# EAGLE design attiny2313devbdfinal1 (EAGLE 5.06)
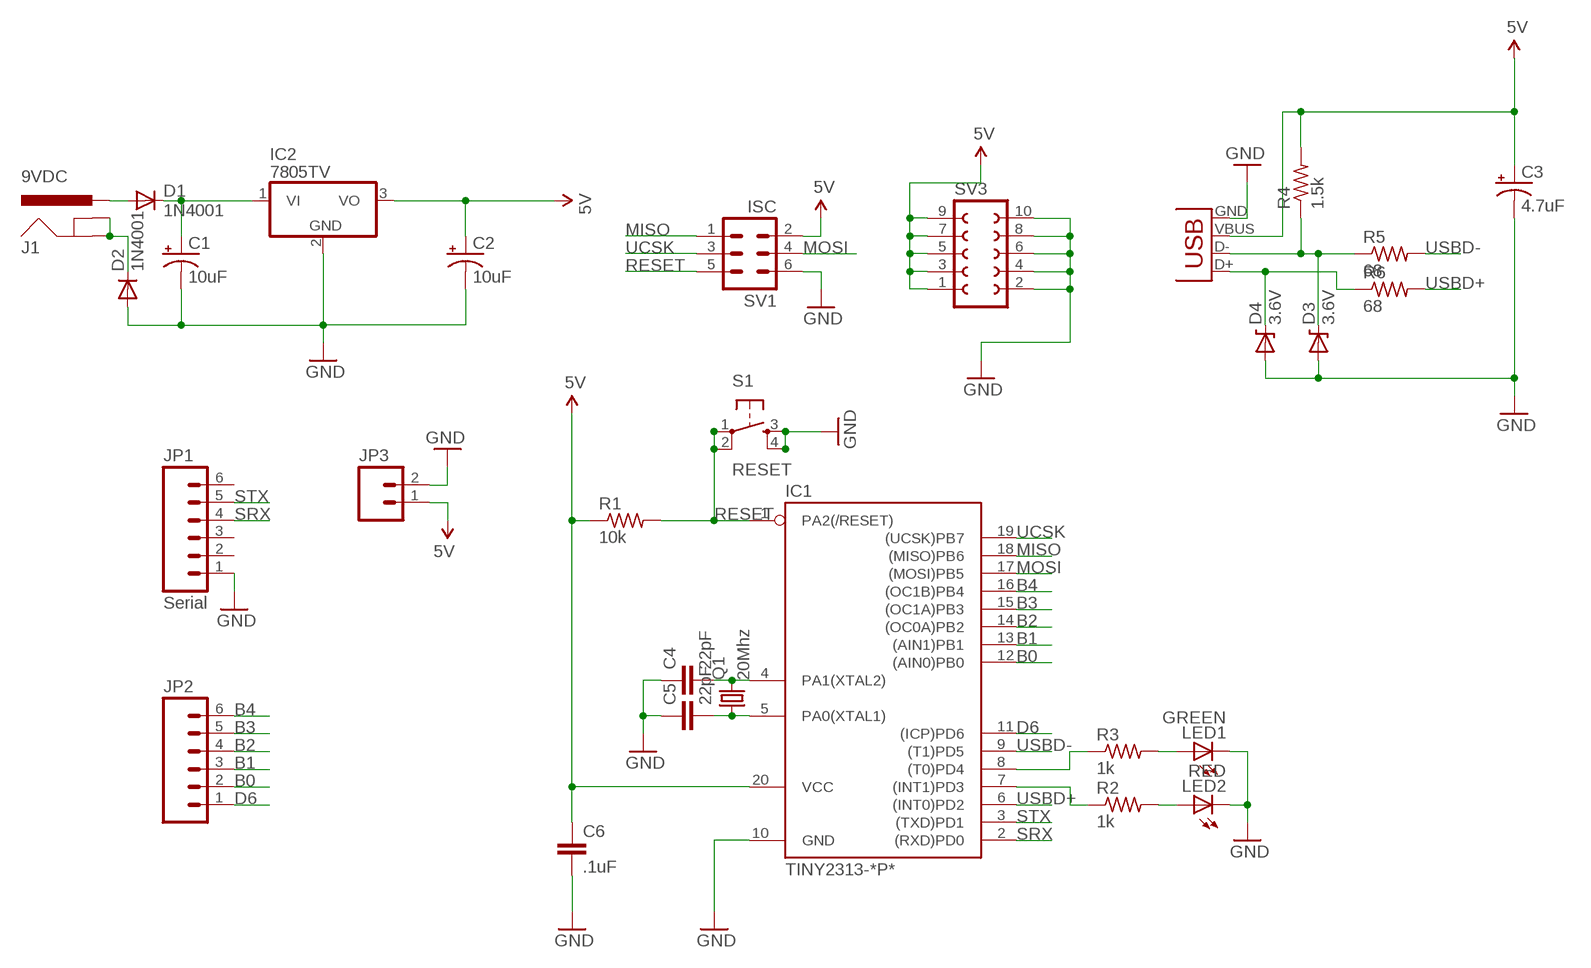
[diagram p0: schematic, sheet 1]

## Parts
C1  10uF  CAP_POLPTH2  [CPOL-RADIAL-10UF-25V]
C2  10uF  CAP_POLPTH2  [CPOL-RADIAL-10UF-25V]
C3  4.7uF  CAP_POLPTH2  [CPOL-RADIAL-10UF-25V]
C4  22pF  CAPPTH2  [CAP-PTH-SMALL2]
C5  22pF  CAPPTH2  [CAP-PTH-SMALL2]
C6  .1uF  CAPPTH2  [CAP-PTH-SMALL2]
D1  1N4001  DIODEPTH  [DIODE-1N4001]
D2  1N4001  DIODEPTH  [DIODE-1N4001]
D3  3.6V  DIODE-ZENERPTH  [DIODE-ZENER]
D4  3.6V  DIODE-ZENERPTH  [DIODE-ZENER]
IC1  TINY2313-*P*  [DIL20]
IC2  7805TV  [TO220V]
J1  9VDC  POWER_JACKPTH  [POWER_JACK_PTH]
JP1  Serial  M06SIP  [1X06]
JP2  M06SIP  [1X06]
JP3  M02PTH  [1X02]
LED1  GREEN  LED3MM  [LED3MM]
LED2  RED  LED3MM  [LED3MM]
Q1  20Mhz  CRYSTALHC49UV  [HC49U-V]
R1  10k  R-US_0207/10  [0207/10]
R2  1k  R-US_0207/10  [0207/10]
R3  1k  R-US_0207/10  [0207/10]
R4  1.5k  R-US_0207/10  [0207/10]
R5  68  R-US_0207/10  [0207/10]
R6  68  R-US_0207/10  [0207/10]
S1  RESET  TAC_SWITCHPTH  [TACTILE-PTH]
SV1  ISC  ML6  [ML6]
SV3  FE05-2  [FE05-2]
X1  USBPTH  [USB-B-PTH]

## Nets
5V [5V]: C2.1(+) C3.1(+) C6.1 IC1.20(VCC) IC2.3(VO) JP3.1 R1.1 R4.2 SV1.2 SV3.1 SV3.3 SV3.5 SV3.7 SV3.9 X1.VBUS
B0: IC1.12((AIN0)PB0) JP2.2
B1: IC1.13((AIN1)PB1) JP2.3
B2: IC1.14((OC0A)PB2) JP2.4
B3: IC1.15((OC1A)PB3) JP2.5
B4: IC1.16((OC1B)PB4) JP2.6
D6: IC1.11((ICP)PD6) JP2.1
GND [GND]: C1.2(-) C2.2(-) C3.2(-) C4.1 C5.1 C6.2 D2.A D3.P$2(A) D4.P$2(A) IC1.10(GND) IC2.2(GND) JP1.1 JP3.2 LED1.K(C) LED2.K(C) S1.3 S1.4 SV1.6 SV3.2 SV3.4 SV3.6 SV3.8 SV3.10 X1.GND
MISO: IC1.18((MISO)PB6) SV1.1
MOSI: IC1.17((MOSI)PB5) SV1.4
N$1: D1.A J1.PWR
N$2: C1.1(+) D1.C IC2.1(VI)
N$3: D2.C J1.GND J1.GNDBREAK
N$4: IC1.8((T0)PD4) R3.1
N$5: IC1.7((INT1)PD3) R2.1
N$6: C4.2 IC1.4(PA1(XTAL2)) Q1.2
N$7: C5.2 IC1.5(PA0(XTAL1)) Q1.1
N$8: LED2.A R2.2
N$9: LED1.A R3.2
N$10: D3.P$1(C) R4.1 R5.1 X1.D-
N$11: D4.P$1(C) R6.1 X1.D+
RESET: IC1.1(PA2(/RESET)) R1.2 S1.1 S1.2 SV1.5
SRX: IC1.2((RXD)PD0) JP1.4
STX: IC1.3((TXD)PD1) JP1.5
UCSK: IC1.19((UCSK)PB7) SV1.3
USBD+: IC1.6((INT0)PD2) R6.2
USBD-: IC1.9((T1)PD5) R5.2
Unconnected: JP1.2 JP1.3 JP1.6

## Library data of the parts
C1-C3 = SparkFun:CAP_POL: Capacitor Polarized These are standard SMD and PTH capacitors. Normally 10uF, 47uF, and 100uF in electrolytic and tantalum varieties. Always verify the external diameter of the through hole cap, it varies with capacity, voltage, and manufacturer. The EIA devices should be standard.
C4-C6 = SparkFun:CAP: Capacitor Standard 0603 ceramic capacitor, and 0.1" leaded capacitor.
D1 D2 = SparkFun:DIODE: Diode These are standard reverse protection diodes and small signal diodes. SMA package can handle up to about 1A. SOD-323 can handle about 200mA. What the SOD-323 package when ordering, there are some mfgs out there that are 5-pin packages.
D3 D4 = SparkFun:DIODE-ZENER: Zener Diode Production Part - 8199 3.4V Zener Voltage
IC1 = avr-6:TINY2313*: Atmel Tiny2313 2K Flash, 128 bytes EEPROM, 128 bytes RAM
IC2 = linear:78*: Positive VOLTAGE REGULATOR Source: http://cache.national.com/ds/LM/LM78L05.pdf http://www.fairchildsemi.com/ds/LM/LM7805.pdf
J1 = SparkFun:POWER_JACK: Power Jack This is the standard 5.5mm barrel jack for power. The PTH is the most common, proven, reliable, footprint. All others are experimental. The Slot footprint only works if the mill layer is transmitted to the PCB fab house so be warned. Spark Fun Electronics SKU : PRT-00119. Mating wall wart : TOL-00298 (and others)
JP1 JP2 = SparkFun:M06: Header 6 Standard 6-pin 0.1" header. Use with straight break away headers (SKU : PRT-00116), right angle break away headers (PRT-00553), swiss pins (PRT-00743), machine pins (PRT-00117), and female headers (PRT-00115). Molex polarized connector foot print use with SKU : PRT-08094 with associated crimp pins and housings. NOTES ON THE VARIANTS LOCK and LOCK_LONGPADS... This footprint was designed to help hold the alignment of a through-hole component (i.e. 6-pin header) while soldering it into place. You may notice that each hole has been shifted either up or down by 0.005 of an inch from it's more standard position (which is a perfectly straight line). This slight alteration caused the pins (the squares in the middle) to touch the edges of the holes. Because they are alternating, it causes a "brace" to hold the component in place. 0.005 has proven to be the perfect amount of "off-center" position when using our standard breakaway headers. Although looks a little odd when you look at the bare footprint, once you have a header in there, the alteration is very hard to notice. Also, if you push a header all the way into place, it is covered up entirely on the bottom side. This idea of altering the position of holes to aid alignment will be further integrated into the Sparkfun Library for other footprints. It can help hold any component with 3 or more connection pins.
JP3 = SparkFun:M02: Header 2 Standard 2-pin 0.1" header. Use with straight break away headers (SKU : PRT-00116), right angle break away headers (PRT-00553), swiss pins (PRT-00743), machine pins (PRT-00117), and female headers (PRT-00115). Molex polarized connector foot print use with SKU : PRT-08233 with associated crimp pins and housings.
LED1 LED2 = SparkFun:LED: LEDs Standard schematic elements and footprints for 5mm, 3mm, 1206, and 0603 sized LEDs. 5mm - Spark Fun Electronics SKU : COM-00529 (and others)
Q1 = SparkFun:CRYSTAL: Crystals Various standard crystals. Proven footprints. Spark Fun Electronics SKU : COM-00534
R1-R6 = resistor:R-US_: RESISTOR, American symbol
S1 = SparkFun:TAC_SWITCH: Momentary Switch Button commonly used for reset or general input. Spark Fun Electronics SKU : COM-00097
SV1 = con-harting-ml:ML6: HARTING
SV3 = con-lsta:FE05-2: FEMALE HEADER
X1 = SparkFun:USB: USB Connectors USB-B-PTH is fully proven SKU : PRT-00139 USB-miniB is fully proven SKU : PRT-00587 USB-A-PCB is untested. USB-A-H is throughly reviewed, but untested. Spark Fun Electronics SKU : PRT-00437 USB-B-SMT is throughly reviewed, but untested. Needs silkscreen touching up. USB-A-S has not been used/tested USB-MB-H has not been used/tested

## Net classes
1 5V: width 0.012 mm
2 GND: width 0.012 mm

## Board
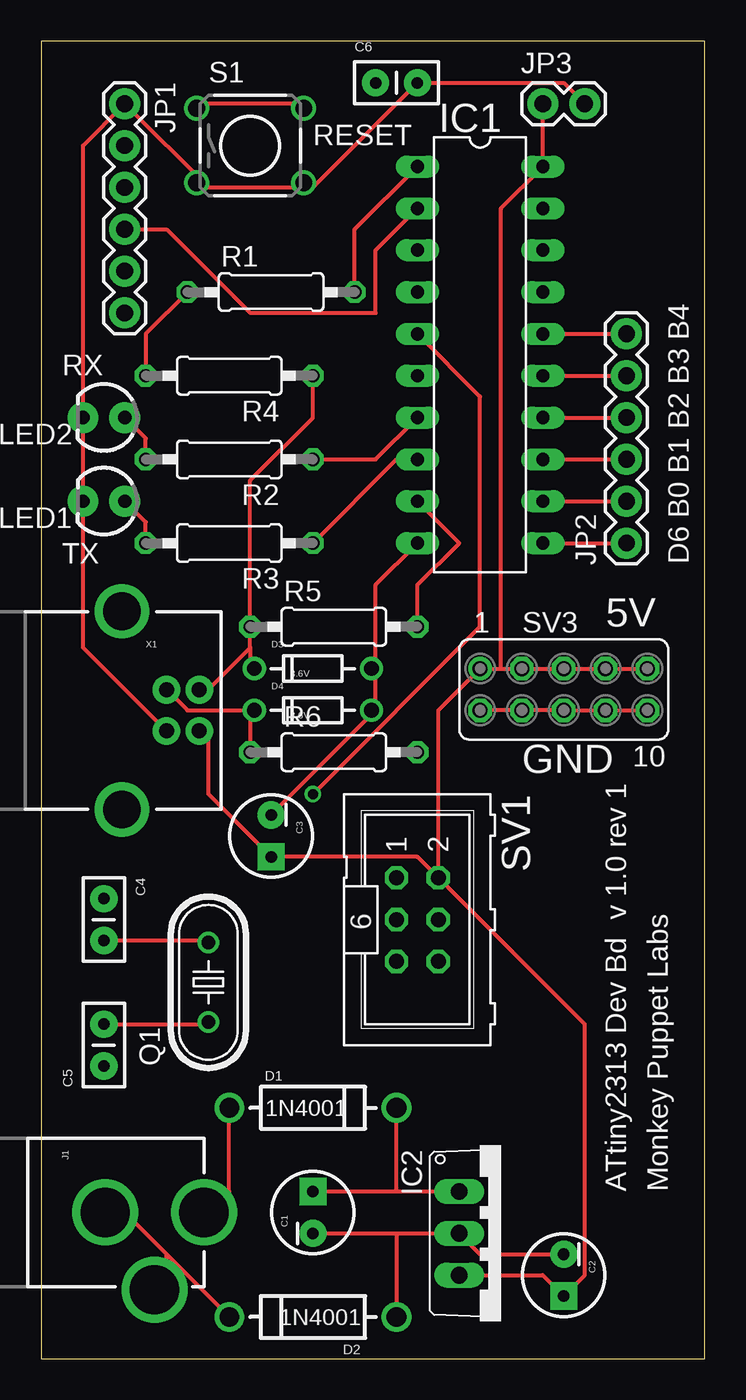
[diagram p1: board, top side]
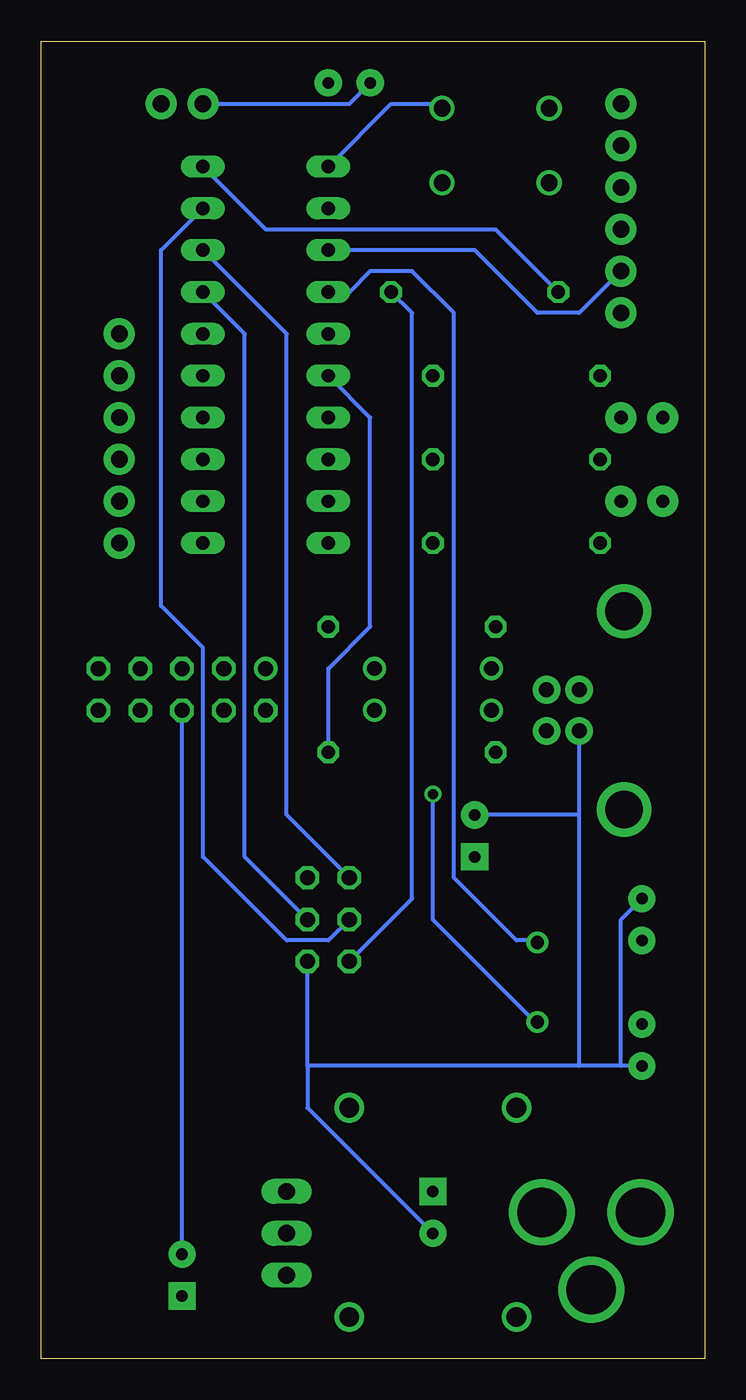
[diagram p2: board, bottom side, seen from below]

Size 40.31 x 80 mm. Coordinates in mm from the lower left corner, seen from the top.
Outline: 0,0 40.31,0 40.31,80 0,80 0,0
Copper layers (1*16): Top 0.035mm / dielectric 1.5mm / Bottom 0.035mm
Design rules "default": minimum track width 10mil, minimum drill 24mil, track to track 8mil, track to pad 8mil, pad to pad 8mil, via to via 8mil, smd to smd 8mil, copper to edge 40mil, drill to drill 8mil, minimum pad ring 10mil, minimum via ring 8mil, stop-mask expansion 4mil, vias tented up to drill 0mil, thermal gap 10mil

### Footprints (pad centres in the part's own frame; a part is rotated, then mirrored left to right if it is on the bottom)
CPOL-RADIAL-10UF-25V = drill 0.7 pad 1.651 square: 1 1.27,0 | drill 0.7 pad 1.651 round: 2 -1.27,0
CAP-PTH-SMALL2 = drill 0.7 pad 1.651 round: 1 0,0; 2 2.54,0
DIODE-1N4001 = drill 1.2 round: A -5.08,0; C 5.08,0
DIODE-ZENER = drill 0.9 round: P$1 -3.556,0; P$2 3.556,0
DIL20 = drill 0.813 long: 1 -11.43,-3.81; 2 -8.89,-3.81; 3 -6.35,-3.81; 4 -3.81,-3.81; 5 -1.27,-3.81; 6 1.27,-3.81; 7 3.81,-3.81; 8 6.35,-3.81; 9 8.89,-3.81; 10 11.43,-3.81; 11 11.43,3.81; 12 8.89,3.81; 13 6.35,3.81; 14 3.81,3.81; 15 1.27,3.81; 16 -1.27,3.81; 17 -3.81,3.81; 18 -6.35,3.81; 19 -8.89,3.81; 20 -11.43,3.81
TO220V = drill 1.016 long: 1 -2.54,-2.54; 2 0,-2.54; 3 2.54,-2.54
POWER_JACK_PTH = drill 2.997 round: GND 0,7.7; GNDBREAK 4.7,10.7; PWR 0,13.7
1X06 = drill 1.016 pad 1.88 round: 1 0,0; 2 2.54,0; 3 5.08,0; 4 7.62,0; 5 10.16,0; 6 12.7,0
1X02 = drill 1.016 pad 1.88 round: 1 0,0; 2 2.54,0
LED3MM = drill 0.813 pad 1.88 round: A -1.27,0; K 1.27,0
HC49U-V = drill 0.813 round: 1 -2.413,0; 2 2.413,0
0207/10 = drill 0.813 octagon: 1 -5.08,0; 2 5.08,0
TACTILE-PTH = drill 1.016 round: 1 -3.251,2.261; 2 3.251,2.261; 3 -3.251,-2.261; 4 3.251,-2.261
ML6 = drill 0.914 octagon: 1 -2.54,-1.27; 2 -2.54,1.27; 3 0,-1.27; 4 0,1.27; 5 2.54,-1.27; 6 2.54,1.27
FE05-2 = drill 0.914 round: 1 -5.08,1.27 | drill 0.914 octagon: 2 -5.08,-1.27; 3 -2.54,1.27; 4 -2.54,-1.27; 5 0,1.27; 6 0,-1.27; 7 2.54,1.27; 8 2.54,-1.27; 9 5.08,1.27; 10 5.08,-1.27
USB-B-PTH = drill 0.914 pad 1.676 round: D+ 0,1.25; D- 1.981,1.25; GND 0,-1.25; VBUS 1.981,-1.25 | drill 2.286 round: P$1 -2.718,-6.02; P$2 -2.718,6.02

### Placement (x,y rotation side)
C1  16.51,8.89 90 top
C2  31.75,5.08 270 top
C3  13.97,31.75 270 top
C4  3.81,27.94 270 top
C5  3.81,17.78 90 top
C6  20.32,77.47 0 top
D1  16.51,15.24 0 top
D2  16.51,2.54 180 top
D3  16.51,41.91 0 top
D4  16.51,39.37 0 top
IC1  26.67,60.96 270 top
IC2  27.94,7.62 270 top
J1  -3.81,8.89 270 top
JP1  5.08,76.2 270 top
JP2  35.56,49.53 90 top
JP3  30.48,76.2 0 top
LED1  3.81,52.07 180 top
LED2  3.81,57.15 180 top
Q1  10.16,22.86 90 top
R1  13.97,64.77 0 top
R2  11.43,54.61 180 top
R3  11.43,49.53 180 top
R4  11.43,59.69 180 top
R5  17.78,44.45 0 top
R6  17.78,36.83 0 top
S1  12.7,73.66 0 top
SV1  22.86,26.67 270 top
SV3  31.75,40.64 0 top
X1  7.62,39.37 0 top

### Tracks (layer width: path | path; a pad name or v marks a point on that pad's centre or on a via)
5V
  Top 0.254: R4.2 6.35,62.23 R1.1 | JP3.1 IC1.20 27.94,69.85 27.94,41.91 | 27.94,41.91 SV3.3 SV3.5 SV3.7 SV3.9 | 27.94,41.91 SV3.1 24.13,39.37 SV1.2 | IC2.3 30.48,5.08 C2.1 33.02,5.08 33.02,20.32 SV1.2 | SV1.2 22.86,30.48 C3.1 10.16,34.29 10.16,38.1 X1.VBUS
  Bottom 0.254: C6.1 21.59,76.2 JP3.1 | R1.1 12.7,68.58 26.67,68.58 IC1.20
B0
  Top 0.254: IC1.12 JP2.2
B1
  Top 0.254: IC1.13 JP2.3
B2
  Top 0.254: IC1.14 JP2.4
B3
  Top 0.254: IC1.15 JP2.5
B4
  Top 0.254: IC1.16 JP2.6
D6
  Top 0.254: IC1.11 JP2.1
GND
  Top 0.254: 10.16,71.12 15.24,71.12 S1.4 16.51,71.12 C6.2 31.75,77.47 JP3.2 | 10.16,71.12 JP1.1 2.54,73.66 LED2.K LED1.K 2.54,43.18 7.62,38.1 X1.GND | 10.16,71.12 S1.3 | IC1.10 20.32,46.99 20.32,41.91 | 20.32,39.37 20.32,41.91 | 20.32,41.91 D3.P$2 | C3.2 20.32,39.37 | 20.32,39.37 D4.P$2 | SV3.2 SV3.4 SV3.6 SV3.8 SV3.10 | C1.2 21.59,7.62 | 21.59,7.62 IC2.2 26.67,6.35 C2.2 | 21.59,7.62 D2.A
  Bottom 0.254: 24.13,17.78 24.13,15.24 C1.2 | 24.13,17.78 SV1.6 | 7.62,17.78 24.13,17.78 | 5.08,17.78 7.62,17.78 | C5.1 5.08,17.78 | C4.1 5.08,26.67 5.08,17.78 | 7.62,17.78 7.62,33.02 | 7.62,33.02 X1.GND | C2.2 SV3.6 | 7.62,33.02 C3.2
MISO
  Bottom 0.254: IC1.18 25.4,62.23 25.4,33.02 SV1.1
MOSI
  Bottom 0.254: IC1.17 27.94,62.23 27.94,30.48 SV1.4
N$1
  Top 0.254: D1.A 11.43,10.16 10.16,8.89 J1.PWR
N$2
  Top 0.254: C1.1 21.59,10.16 | 21.59,10.16 IC2.1 | 21.59,10.16 D1.C
N$3
  Top 0.254: 7.62,6.35 5.08,8.89 J1.GND | 7.62,6.35 D2.C | 7.62,6.35 7.62,5.08 J1.GNDBREAK
N$4
  Top 0.254: R3.1 21.59,54.61 IC1.8
N$5
  Top 0.254: R2.1 20.32,54.61 IC1.7
N$6
  Top 0.254: C4.2 10.16,25.4 Q1.2
  Bottom 0.254: IC1.4 21.59,64.77 20.32,66.04 17.78,66.04 15.24,63.5 15.24,29.21 11.43,25.4 10.16,25.4 Q1.2
N$7  (via drill 0.61)
  Top 0.254: C5.2 10.16,20.32 Q1.1 | IC1.5 26.67,58.42 26.67,44.45 v16.51,34.29
  Bottom 0.254: v16.51,34.29 16.51,26.67 10.16,20.32 Q1.1
N$8
  Top 0.254: R2.2 6.35,55.88 LED2.A
N$9
  Top 0.254: R3.2 6.35,50.8 LED1.A
N$10
  Top 0.254: 12.7,43.18 12.7,41.91 D3.P$1 | 12.7,43.18 R5.1 12.7,53.34 16.51,57.15 R4.1 | 12.7,43.18 10.16,40.64 X1.D-
N$11
  Top 0.254: 12.7,39.37 R6.1 | 12.7,39.37 8.89,39.37 7.62,40.64 X1.D+ | 12.7,39.37 D4.P$1
RESET
  Top 0.254: S1.1 10.16,76.2 15.24,76.2 S1.2 | R1.2 19.05,68.58 IC1.1
  Bottom 0.254: SV1.5 17.78,27.94 17.78,63.5 R1.2 | IC1.1 19.05,76.2 16.51,76.2 S1.2
SRX
  Top 0.254: IC1.2 20.32,67.31 20.32,63.5 12.7,63.5 7.62,68.58 JP1.4
STX
  Bottom 0.254: IC1.3 13.97,67.31 10.16,63.5 7.62,63.5 JP1.5
UCSK
  Bottom 0.254: IC1.19 33.02,67.31 33.02,45.72 30.48,43.18 30.48,30.48 25.4,25.4 22.86,25.4 SV1.3
USBD+
  Bottom 0.254: R6.2 22.86,41.91 20.32,44.45 20.32,57.15 IC1.6
USBD-
  Top 0.254: R5.2 22.86,46.99 25.4,49.53 IC1.9

### Text on the board
_tsilk: RESET | RX | TX | D6 B0 B1 B2 B3 B4 | 5V | GND | v 1.0 rev 1 | ATtiny2313 Dev Bd | Monkey Puppet Labs